# EAGLE design circle_button (EAGLE 7.4.0)
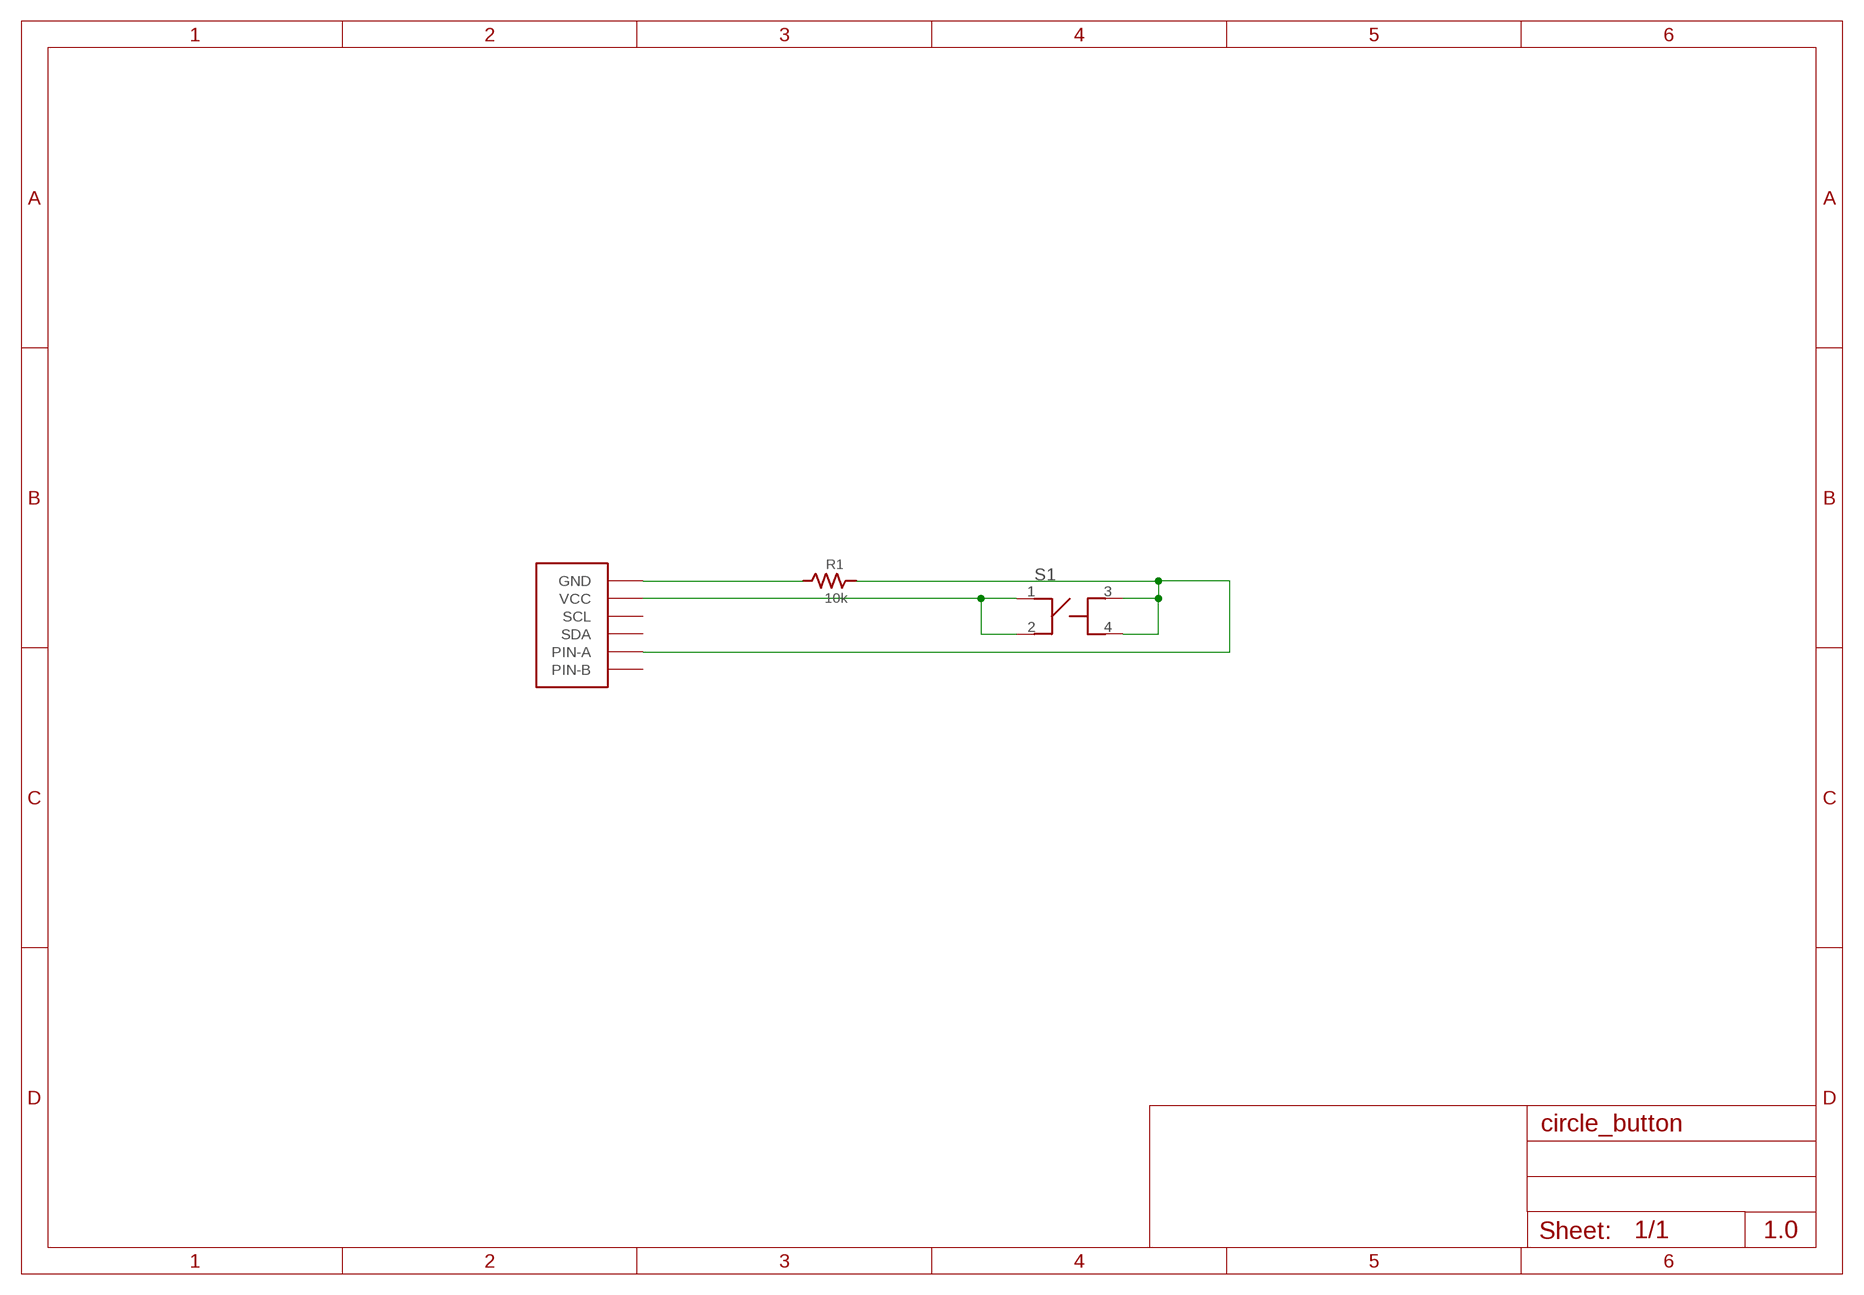
[diagram p0: schematic, sheet 1]

## Parts
R1  10k  RESISTOR-0402  [0402]
S1  SWITCH-LS6J2M-T  [SWITCH-LS6J2M-T]
U$2  FABO-NANO  [FABO-NANO]

## Nets
GND: R1.P$1 U$2.GND
N$1: S1.1 S1.2 U$2.VCC
N$3: R1.P$2 S1.3 S1.4 U$2.2(PIN-A)
Unconnected: U$2.0(SCL) U$2.1(SDA) U$2.3(PIN-B)

## Notes on the sheet
- 1.0

## Library data of the parts
R1 = FaBo-Resistors:RESISTOR: RESISTOR
S1 = gclue:SWITCH-LS6J2M-T: Switch Tact SMD(LS6J2M-T)
U$2 = FaBo-Template:FABO-NANO

## Board
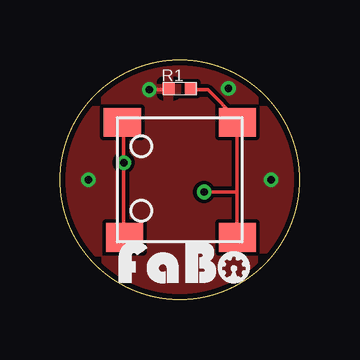
[diagram p1: board, top side]
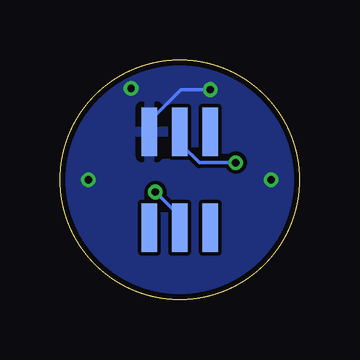
[diagram p2: board, bottom side, seen from below]

Size 10 x 10 mm. Coordinates in mm from the lower left corner, seen from the top.
Copper layers (1*16): Top 0.035mm / dielectric 1.5mm / Bottom 0.035mm
Design rules "Elecrow_2-layer_eagle_rule": minimum track width 6mil, minimum drill 12mil, track to track 6mil, track to pad 6mil, pad to pad 6mil, via to via 6mil, smd to smd 0mil, copper to edge 10mil, drill to drill 10mil, minimum pad ring 10mil, minimum via ring 6mil, stop-mask expansion 2mil, vias tented up to drill 100mil, thermal gap 10mil

### Footprints (pad centres in the part's own frame; a part is rotated, then mirrored left to right if it is on the bottom)
0402 = smd 0.5 x 0.5: P$1 -0.46,0; P$2 0.46,0
SWITCH-LS6J2M-T = smd 1.55 x 1.2: 1 -2.4,2.4; 2 -2.3,-2.4; 3 2.4,2.4; 4 2.4,-2.4
FABO-NANO = smd 0.635 x 2.032 bottom: 0 -1.27,2; 1 1.27,-2; 2 0,-2; 3 -1.27,-2; GND 1.27,2; VCC 0,2

### Placement (x,y rotation side)
R1  5,8.81 0 top
S1  5,5 0 top
U$1  [LOGO_FABO_S]  5.25,0.68 0 top
U$2  5,5 0 top

### Tracks (layer width: path | path; a pad name or v marks a point on that pad's centre or on a via)
GND  (via drill 0.3)
  Top 0.152: v3.73,8.76 4.49,8.76 R1.P$1
  Bottom 0.152: v3.73,8.76 4.95,8.76 6.17,7.54 6.17,7.08 U$2.GND
  other vias: 1.19,5 8.81,5 7.03,8.81
  pour Top: -0.08,-0.08 10.08,-0.08 10.08,10.08 -0.08,10.08
  pour Bottom: -0.08,-0.08 10.08,-0.08 10.08,10.08 -0.08,10.08
N$1  (via drill 0.3)
  Top 0.152: S1.2 2.66,2.66 v2.66,5.71 2.66,7.39 S1.1
  Bottom 0.152: v2.66,5.71 4.19,5.71 4.95,6.47 4.95,6.93 U$2.VCC
N$3  (via drill 0.3)
  Top 0.152: R1.P$2 5.56,8.76 6.17,8.76 7.39,7.54 S1.3 7.39,7.39 7.39,4.49 | 7.39,4.49 7.39,2.66 S1.4 | 7.39,4.49 v6.02,4.49
  Bottom 0.152: v6.02,4.49 5.1,3.58 5.1,3.12 U$2.2